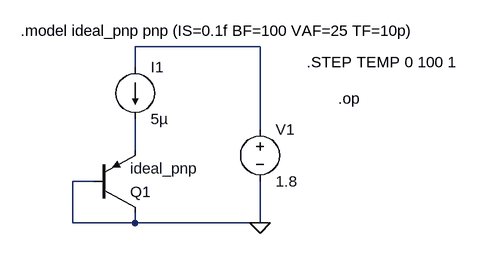
[diagram p0: schematic bandgap_ref.asc]
bandgap_ref.asc, the LTspice schematic file:
Version 4
SHEET 1 912 680
WIRE 576 0 384 0
WIRE 384 32 384 0
WIRE 576 128 576 0
WIRE 384 160 384 112
WIRE 320 208 288 208
WIRE 288 272 288 208
WIRE 384 272 384 256
WIRE 384 272 288 272
WIRE 576 272 576 208
WIRE 576 272 384 272
FLAG 576 272 0
SYMBOL pnp 320 256 M180
SYMATTR InstName Q1
SYMATTR Value ideal_pnp
SYMBOL current 384 32 R0
WINDOW 123 0 0 Left 0
WINDOW 39 0 0 Left 0
SYMATTR InstName I1
SYMATTR Value 5µ
SYMBOL voltage 576 112 R0
WINDOW 123 0 0 Left 0
WINDOW 39 0 0 Left 0
SYMATTR InstName V1
SYMATTR Value 1.8
TEXT 208 -24 Left 0 !.model ideal_pnp pnp (IS=0.1f BF=100 VAF=25 TF=10p)
TEXT 696 80 Left 0 !.op
TEXT 648 24 Left 0 !.STEP TEMP 0 100 1

The netlist it stands for:
* bandgap_ref.asc
Q1 0 0 N002 0 ideal_pnp
I1 N001 N002 5µ
V1 N001 0 1.8
.model NPN NPN
.model PNP PNP
.lib standard.bjt
.model ideal_pnp pnp (IS=0.1f BF=100 VAF=25 TF=10p)
.op
.STEP TEMP 0 100 1
.backanno
.end